# EAGLE schematic CircuitWithControlPanel (EAGLE 9.7.0)
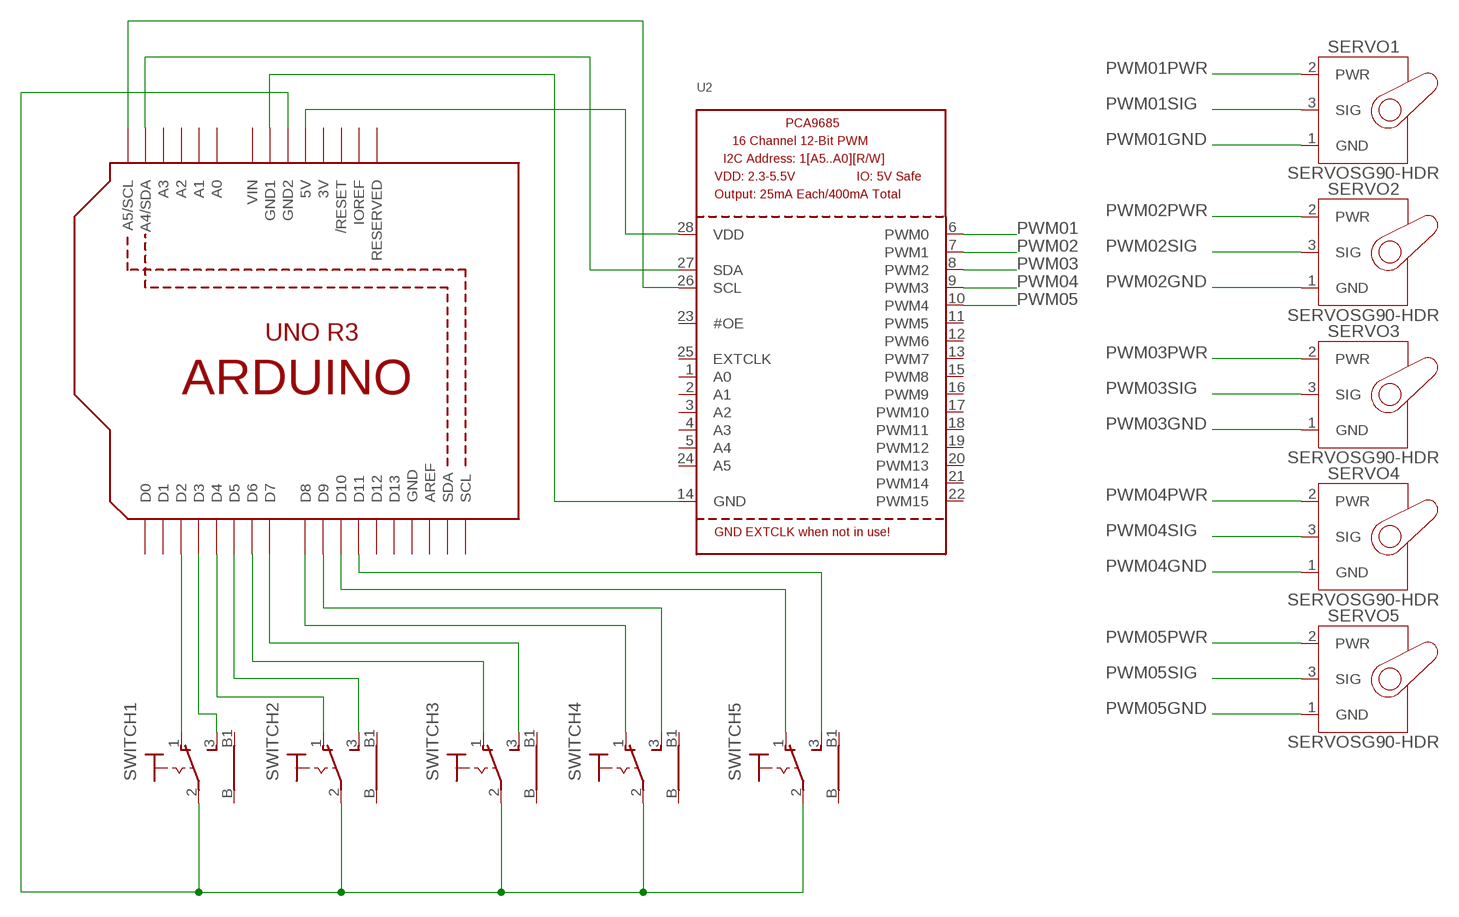
[diagram p0: schematic, sheet 1]

## Parts
SERVO1  SERVOSG90-HDR  [1X03]
SERVO2  SERVOSG90-HDR  [1X03]
SERVO3  SERVOSG90-HDR  [1X03]
SERVO4  SERVOSG90-HDR  [1X03]
SERVO5  SERVOSG90-HDR  [1X03]
SWITCH1  316-917  [316-917]
SWITCH2  316-917  [316-917]
SWITCH3  316-917  [316-917]
SWITCH4  316-917  [316-917]
SWITCH5  316-917  [316-917]
U1  ARDUINOR3-DIMENSION  [ARDUINOR3]
U2  PCA9685  [TSSOP28]

## Nets
N$1: U1.GND1 U2.14(GND)
N$2: U1.5V U2.28(VDD)
N$3: U1.A4(A4/SDA) U2.27(SDA)
N$4: U1.A5(A5/SCL) U2.26(SCL)
N$5: SWITCH1.2(P) SWITCH2.2(P) SWITCH3.2(P) SWITCH4.2(P) SWITCH5.2(P) U1.GND2
N$6: SWITCH1.1(O) U1.D2
N$7: SWITCH1.3(S) U1.D3
N$8: SWITCH2.1(O) U1.D4
N$9: SWITCH2.3(S) U1.D5
N$10: SWITCH3.1(O) U1.D6
N$11: SWITCH3.3(S) U1.D7
N$12: SWITCH4.1(O) U1.D8
N$13: SWITCH4.3(S) U1.D9
N$14: SWITCH5.1(O) U1.D10
N$15: SWITCH5.3(S) U1.D11
PWM01: U2.6(PWM0)
PWM01GND: SERVO1.1(GND)
PWM01PWR: SERVO1.2(PWR)
PWM01SIG: SERVO1.3(SIG)
PWM02: U2.7(PWM1)
PWM02GND: SERVO2.1(GND)
PWM02PWR: SERVO2.2(PWR)
PWM02SIG: SERVO2.3(SIG)
PWM03: U2.8(PWM2)
PWM03GND: SERVO3.1(GND)
PWM03PWR: SERVO3.2(PWR)
PWM03SIG: SERVO3.3(SIG)
PWM04: U2.9(PWM3)
PWM04GND: SERVO4.1(GND)
PWM04PWR: SERVO4.2(PWR)
PWM04SIG: SERVO4.3(SIG)
PWM05: U2.10(PWM4)
PWM05GND: SERVO5.1(GND)
PWM05PWR: SERVO5.2(PWR)
PWM05SIG: SERVO5.3(SIG)
Unconnected: SWITCH1.B SWITCH1.B1 SWITCH2.B SWITCH2.B1 SWITCH3.B SWITCH3.B1 SWITCH4.B SWITCH4.B1 SWITCH5.B SWITCH5.B1 U1.A0 U1.A1 U1.A2 U1.A3 U1.AREF U1.D0 U1.D1 U1.D12 U1.D13 U1.IOREF U1.RESERVED U1.RESET(/RESET) U1.SCL U1.SDA U2.1(A0) U2.2(A1) U2.3(A2) U2.4(A3) U2.5(A4) U2.11(PWM5) U2.12(PWM6) U2.13(PWM7) U2.15(PWM8) U2.16(PWM9) U2.17(PWM10) U2.18(PWM11) U2.19(PWM12) U2.20(PWM13) U2.21(PWM14) U2.22(PWM15) U2.23(#OE) U2.24(A5) U2.25(EXTCLK)

## Power pins joined to a net without a drawn wire
3V: U1.3V
GND: U1.GND
VIN: U1.VIN

## Library data of the parts
SERVO1-SERVO5 = Tinkercad:SERVO
SWITCH1-SWITCH5 = switch:316-917: TOGGLE SWITCH Mors, distributor RS Components
U1 = adafruit:ARDUINOR3: This is a new object for the new Arduino R3 - with extra pins that you may want to use (such as IOref, and duplicated A4/A5
U2 = adafruit:PCA9685: PCA9685 - 16 Channel 12-Bit I2C PWM Controller 5.0V tolerant 16 channel, 12-bit I2C PWM controller with 25mA per output (max. 400mA total) Digikey: 568-5931-1-ND